# Altium schematic sheet Stlink.SchDoc
size A4; Revision: B.2(PCB.SCH)
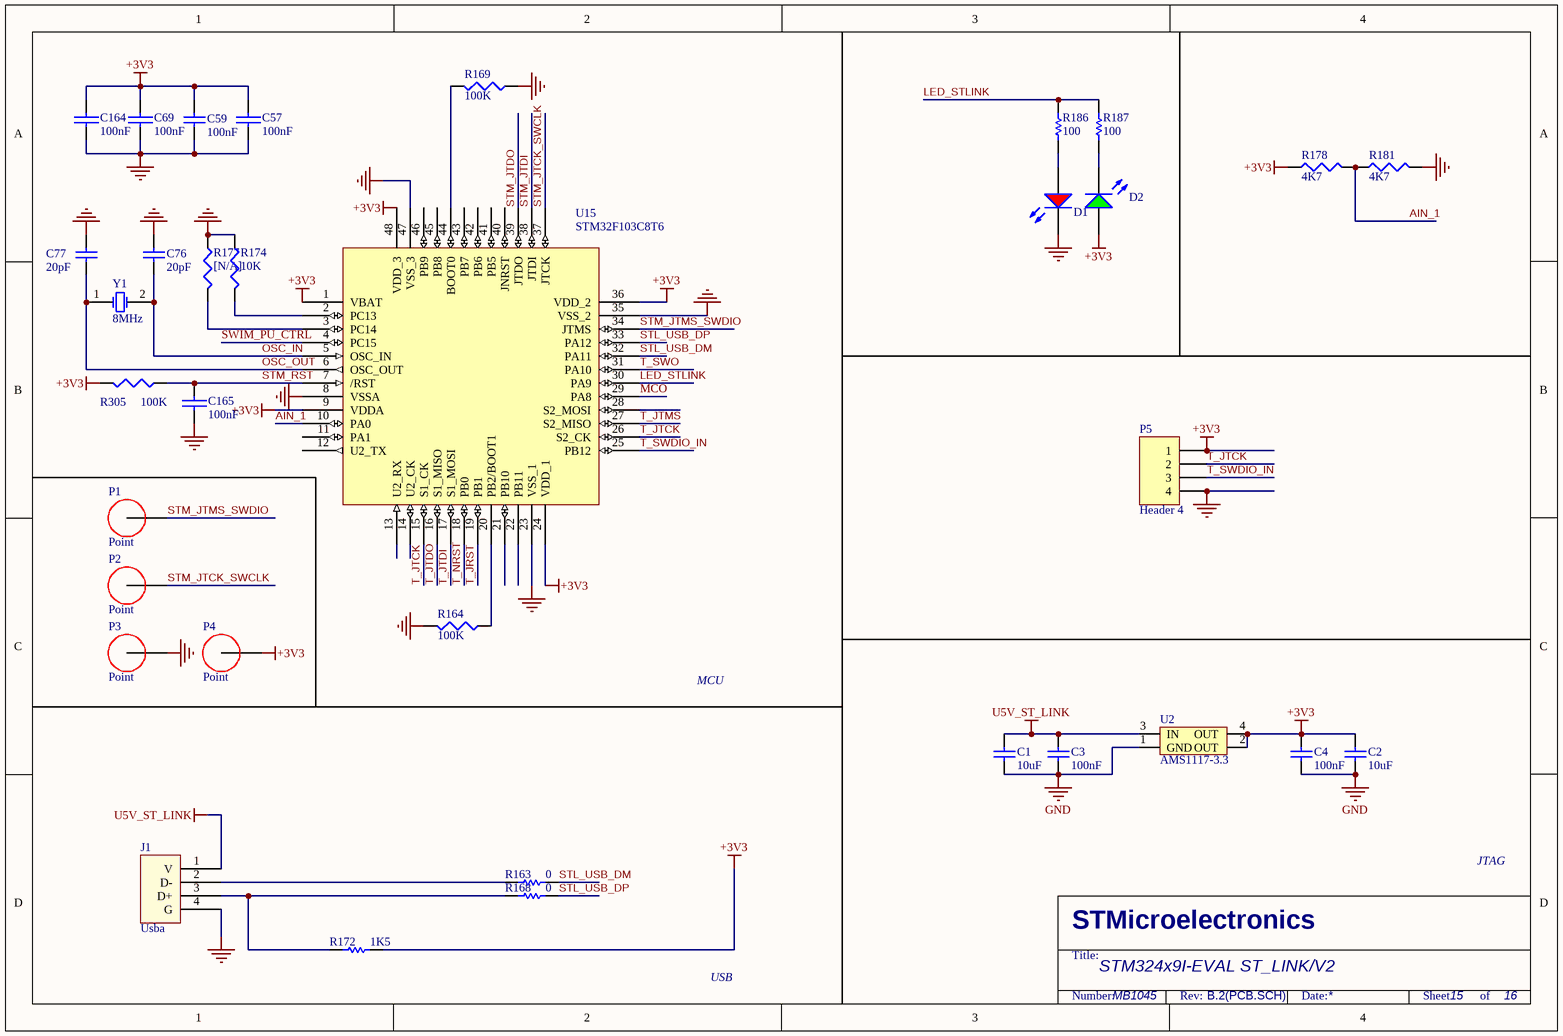
[diagram p0: Stlink.SchDoc]

## Parts
C1  10uF  [0805_C]
C2  10uF  [0805_C]
C3  100nF  [0603_C]
C4  100nF  [0603_C]
C57  100nF  [0603_C]
C59  100nF  [0603_C]
C69  100nF  [0603_C]
C76  20pF  [0603_C]
C77  20pF  [0603_C]
C164  100nF  [0603_C]
C165  100nF  [0603_C]
D1  红灯 0805  [0805_LED_S1]  (value not drawn)
D2  翠绿 0805  [0805_LED_S1]  (value not drawn)
J1  Usba  [UsbA]
P1  Point  [POINT]
P2  Point  [POINT]
P3  Point  [POINT]
P4  Point  [POINT]
P5  Header 4  [HDR1X4]
R163  0  [0603_R]
R164  100K  [0603_R]
R168  0  [0603_R]
R169  100K  [0603_R]
R172  1K5  [0603_R]
R174  10K  [0603_R]
R177  [N/A]  [0603_R]
R178  4K7  [0603_R]
R181  4K7  [0603_R]
R186  100  [0603_R]
R187  100  [0603_R]
R305  100K  [0603_R]
U2  AMS1117-3.3  [AMS1117]
U15  STM32F103C8T6  [LQFP-48_7x7x05P]
Y1  8MHz  [XTAL_US]

## Nets
+3V3: C2.2 C4.2 C57.2 C59.1 C69.2 C164.2 D2.A P4.1 P5.1 R172.1 R178.1 R305.2 U2.2(OUT) U2.4(OUT) U15.1(VBAT) U15.9(VDDA) U15.24(VDD_1) U15.36(VDD_2) U15.48(VDD_3)
GND: C1.1 C2.1 C3.1 C4.1 C57.1 C59.2 C69.1 C76.1 C77.1 C164.1 C165.1 D1.K J1.4(G) P3.1 P5.4 R164.2 R169.1 R174.1 R177.1 R181.2 U2.1(GND) U15.8(VSSA) U15.23(VSS_1) U15.35(VSS_2) U15.47(VSS_3)
U5V_ST_LINK: C1.2 C3.2 J1.1(V) U2.3(IN)
AIN_1: R178.2 R181.1 U15.10(PA0)
LED_STLINK: R186.1 R187.1 U15.30(PA9)
MCO: U15.29(PA8)
OSC_IN: C76.2 U15.5(OSC_IN) Y1.2(OSC2)
OSC_OUT: C77.2 U15.6(OSC_OUT) Y1.1(OSC1)
STL_USB_DM: R163.1 U15.32(PA11)
STL_USB_DP: R168.1 U15.33(PA12)
STM_JTCK_SWCLK: P2.1 U15.37(JTCK)
STM_JTDI: U15.38(JTDI)
STM_JTDO: U15.39(JTDO)
STM_JTMS_SWDIO: P1.1 U15.34(JTMS)
STM_RST: C165.2 R305.1 U15.7(/RST)
SWIM_PU_CTRL: U15.4(PC15)
T_JRST: U15.19(PB1)
T_JTCK: P5.2 U15.15(S1_CK) U15.26(S2_CK)
T_JTDI: U15.17(S1_MOSI)
T_JTDO: U15.16(S1_MISO)
T_JTMS: U15.27(S2_MISO)
T_NRST: U15.18(PB0)
T_SWDIO_IN: P5.3 U15.25(PB12)
T_SWO: U15.31(PA10)
NetD1_A: D1.A R186.2
NetD2_K: D2.K R187.2
NetJ1_2: J1.2(D-) R163.2
NetJ1_3: J1.3(D+) R168.2 R172.2
NetR164_1: R164.1 U15.20(PB2/BOOT1)
NetR169_2: R169.2 U15.44(BOOT0)
NetR174_2: R174.2 U15.2(PC13)
NetR177_2: R177.2 U15.3(PC14)

Not connected (* = marked no-connect by the designer): U15 11(PA1) 12(U2_TX) 13(U2_RX) 14(U2_CK) 21(PB10) 22(PB11) 28(S2_MOSI) 40(JNRST) 41(PB5) 42(PB6) 43(PB7) 45(PB8) 46(PB9)

## Notes on the sheet
- MCU
- JTAG
- USB
- STM324x9I-EVAL ST_LINK/V2
- MB1045
- 15
- 16
- STMicroelectronics
- Title:
- Number:
- Rev:
- Date:
- Sheet          of

## Library data of the parts
C1 C2 = 0805 10uF (106) 10% 25V: 贴片电容; ComponentLink1Description: 供应商链接; ComponentLink1URL: http://www.szlcsc.com/product/details_16532.html; Package: 0805; Supplier: LC; SuppliersPartNumber: C15850
C3 C4 = 0603 100nF (104) 10% 50V: 贴片电容; ComponentLink1Description: 供应商链接; ComponentLink1URL: http://www.szlcsc.com/product/details_15331.html; Package: 0603; Supplier: LC; SuppliersPartNumber: C14663
C57 C69 C164 C165 = CAP
C59 = Cap: Capacitor; Value: 10nF; Published: 8-Jun-2000; Revision: July-2002: Re-released for DXP Platform.; Publisher: Altium Limited
C76 C77 = Cap: Capacitor; Published: 8-Jun-2000; LatestRevisionDate: 17-Jul-2002; LatestRevisionNote: Re-released for DXP Platform.; PackageReference: RAD-0.3; Publisher: Altium Limited; Value: 20pF
D1 = 0805 红灯: 发光二极管; ComponentLink1Description: 供应商链接; ComponentLink1URL: http://www.szlcsc.com/product/details_2668.html; Package: 0805; Supplier: LC; SuppliersPartNumber: C2295
D2 = 0805 翠绿: 发光二极管; ComponentLink1Description: 供应商链接; ComponentLink1URL: http://www.szlcsc.com/product/details_2670.html; Package: 0805; Supplier: LC; SuppliersPartNumber: C2297
P5 = Header 4: Header, 4-Pin; LatestRevisionDate: 17-Jul-2002; LatestRevisionNote: Re-released for DXP Platform.; Publisher: Altium Limited
R163 R168 R172 R186 R187 = Res1: Resistor; Value: 1K; Published: 8-Jun-2000; Revision: July-2002: Re-released for DXP Platform.; Publisher: Altium Limited
R164 R169 R178 R181 R305 = RES1
R174 R177 = R: Right: 20; Bottom: 30
U2 = AMS1117
U15 = STM32F10x(48pin)
Y1 = XTAL: Crystal Oscillator; Published: 8-Jun-2000; LatestRevisionDate: 17-Jul-2002; LatestRevisionNote: Re-released for DXP Platform.; Publisher: Altium Limited